# EAGLE design neurite-core (EAGLE 7.3.0)
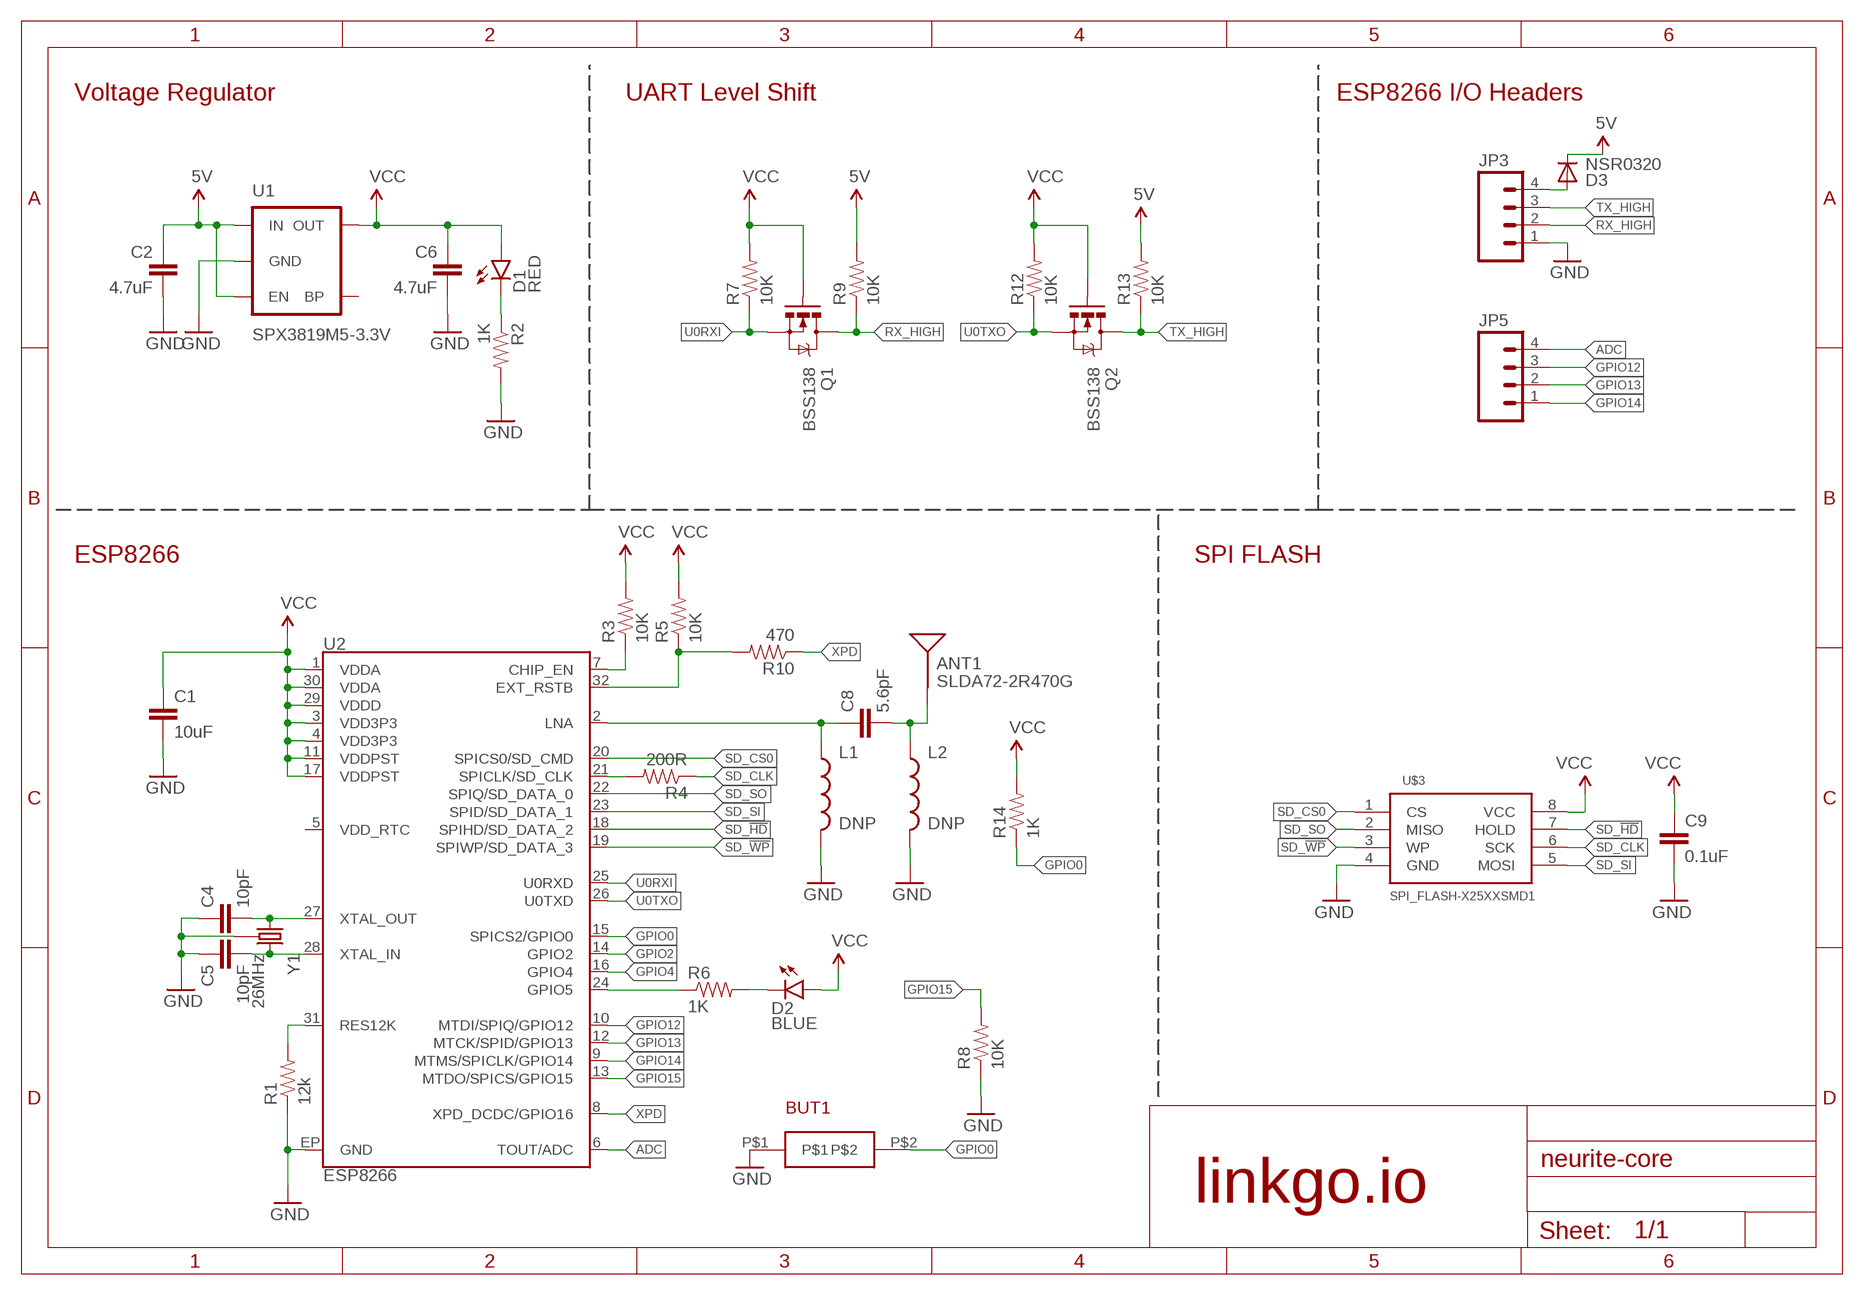
[diagram p0: schematic, sheet 1]

## Parts
ANT1  SLDA72-2R470G  ANTENNA2SMD6  [ANTENNA-CHIP6]
BUT1  SWITCH  [SWITCH]
C1  10uF  CAP0402-CAP  [0402-CAP]
C2  4.7uF  1.0UF-25V-+80/-20(0805)  [0805]
C4  10pF  CAP0402-CAP  [0402-CAP]
C5  10pF  CAP0402-CAP  [0402-CAP]
C6  4.7uF  2.2UF-10V-20%(0603)  [0603-CAP]
C8  5.6pF  CAP0402-CAP  [0402-CAP]
C9  0.1uF  CAP0402-CAP  [0402-CAP]
D1  RED  LED-RED0603  [LED-0603]
D2  BLUE  LED-BLUE0603  [LED-0603]
D3  NSR0320  DIODESOD  [SOD-323]
JP3  M04PTH  [1X04]
JP5  M04PTH  [1X04]
L1  DNP  INDUCTOR0402  [C0402]
L2  DNP  INDUCTOR0402  [C0402]
Q1  BSS138  MOSFET-NCHANNELBSS138  [SOT23-3]
Q2  BSS138  MOSFET-NCHANNELBSS138  [SOT23-3]
R1  12k  RESISTOR0402-RES  [0402-RES]
R2  1K  RESISTOR0402-RES  [0402-RES]
R3  10K  RESISTOR0402-RES  [0402-RES]
R4  200R  RESISTOR0402-RES  [0402-RES]
R5  10K  RESISTOR0402-RES  [0402-RES]
R6  1K  RESISTOR0402-RES  [0402-RES]
R7  10K  RESISTOR0402-RES  [0402-RES]
R8  10K  RESISTOR0402-RES  [0402-RES]
R9  10K  RESISTOR0402-RES  [0402-RES]
R10  470  RESISTOR0402-RES  [0402-RES]
R12  10K  RESISTOR0402-RES  [0402-RES]
R13  10K  RESISTOR0402-RES  [0402-RES]
R14  1K  RESISTOR0402-RES  [0402-RES]
U1  SPX3819M5-3.3V  V_REG_LDOSMD  [SOT23-5]
U2  ESP8266  [QFN32]
U$3  SPI_FLASH-X25XXSMD1  [SO08-EIAJ]
Y1  26MHz  CRYSTAL-GROUNDED3.2X2.5  [CRYSTAL-SMD-3.2X2.5]

## Nets
5V: C2.1 D3.1(C) R9.2 R13.2 U1.1(IN) U1.3(EN)
ADC: JP5.4 U2.6(TOUT/ADC)
CHIP_EN: R3.1 U2.7(CHIP_EN)
GND: BUT1.P$1 C1.2 C2.2 C4.1 C5.1 C6.2 C9.2 JP3.1 L1.2 L2.2 R1.1 R2.2 R8.1 U1.2(GND) U2.EP(GND) U$3.4(GND) Y1.2(GND) Y1.4(GND)
GPIO0: BUT1.P$2 R14.1 U2.15(SPICS2/GPIO0)
GPIO2: U2.14(GPIO2)
GPIO4: U2.16(GPIO4)
GPIO5: R6.1 U2.24(GPIO5)
GPIO12: JP5.3 U2.10(MTDI/SPIQ/GPIO12)
GPIO13: JP5.2 U2.12(MTCK/SPID/GPIO13)
GPIO14: JP5.1 U2.9(MTMS/SPICLK/GPIO14)
GPIO15: R8.2 U2.13(MTDO/SPICS/GPIO15)
LNA: C8.1 L1.1 U2.2(LNA)
N$1: R1.2 U2.31(RES12K)
N$2: C5.2 U2.28(XTAL_IN) Y1.3
N$3: C4.2 U2.27(XTAL_OUT) Y1.1
N$4: D1.C R2.1
N$5: ANT1.1(SIGNAL) C8.2 L2.1
N$6: R4.2 U2.21(SPICLK/SD_CLK)
N$7: D3.2(A) JP3.4
N$9: D2.C R6.2
RESET: R5.1 R10.2 U2.32(EXT_RSTB)
RX_HIGH: JP3.2 Q1.3(D) R9.1
SD_!HD!: U2.18(SPIHD/SD_DATA_2) U$3.7(HOLD)
SD_!WP!: U2.19(SPIWP/SD_DATA_3) U$3.3(WP)
SD_CLK: R4.1 U$3.6(SCK)
SD_CS0: U2.20(SPICS0/SD_CMD) U$3.1(CS)
SD_SI: U2.23(SPID/SD_DATA_1) U$3.5(MOSI)
SD_SO: U2.22(SPIQ/SD_DATA_0) U$3.2(MISO)
TX_HIGH: JP3.3 Q2.3(D) R13.1
U0RXI: Q1.2(S) R7.1 U2.25(U0RXD)
U0TXO: Q2.2(S) R12.1 U2.26(U0TXD)
VCC: C1.1 C6.1 C9.1 D1.A D2.A Q1.1(G) Q2.1(G) R3.2 R5.2 R7.2 R12.2 R14.2 U1.5(OUT) U2.1(VDDA) U2.3(VDD3P3) U2.4(VDD3P3) U2.11(VDDPST) U2.17(VDDPST) U2.29(VDDD) U2.30(VDDA) U$3.8(VCC)
XPD: R10.1 U2.8(XPD_DCDC/GPIO16)
Unconnected: U1.4(BP) U2.5(VDD_RTC)

## Notes on the sheet
- Voltage Regulator | UART Level Shift | ESP8266 I/O Headers
- ESP8266 | SPI FLASH
- linkgo.io

## Library data of the parts
ANT1 = SparkFun:ANTENNA2: Antenna Single endded antenna. Common with smaller chip antennas. CHIP4 package is the GPS Chip Antenna SKU: GPS-08418. CHIP5 package is 2.4GHz chip antenna SKU: WRL-00144.
BUT1 = Sincoheren:SWITCH
C1 C4 C5 C9 = SparkFun:CAP: Capacitor Standard 0603 ceramic capacitor, and 0.1" leaded capacitor.
C2 = SparkFun-Capacitors:1.0UF-25V-+80/-20(0805): CAP-11625; PROD_ID: CAP-11625; VALUE: 1.0uF
C6 = SparkFun-Capacitors:2.2UF-10V-20%(0603): CAP-07888; PROD_ID: CAP-07888; VALUE: 2.2uF
C8 = SparkFun:CAP: Capacitor Standard 0603 ceramic capacitor, and 0.1" leaded capacitor.; PROD_ID: CAP-12456
D1 = SparkFun-LED:LED-RED: Assorted Red LEDs LilyPad 1206- DIO-09912 1206- DIO-00809 0603- DIO-00819; PROD_ID: DIO-00819
D2 = SparkFun-LED:LED-BLUE: Blue LEDs for production use Various blue LEDs stocked by SparkFun production 0603 - DIO-08575 Rebel - DIO-09553 1206 - DIO-09911; PROD_ID: DIO-08575
D3 = SparkFun:DIODE: Diode These are standard reverse protection diodes and small signal diodes. SMA package can handle up to about 1A. SOD-323 can handle about 200mA. What the SOD-323 package when ordering, there are some mfgs out there that are 5-pin packages.
JP3 JP5 = SparkFun:M04: Header 4 Standard 4-pin 0.1" header. Use with straight break away headers (SKU : PRT-00116), right angle break away headers (PRT-00553), swiss pins (PRT-00743), machine pins (PRT-00117), and female headers (PRT-00115). Molex polarized connector foot print use with SKU : PRT-08231 with associated crimp pins and housings.
L1 L2 = SparkFun:INDUCTOR: Inductors Basic Inductor/Choke - 0603 and 1206. Footprints are not proven and vary greatly between part numbers.
Q1 Q2 = SparkFun-DiscreteSemi:MOSFET-NCHANNEL: Common NMOSFET Parts MFG P/N Store ID Prod ID FDD8780 TRANS-09984 SI7820DN TRANS-11055 FDS6630A IC-08089 2N7002PW TRANS-11151 FQP30N06L COM-10213 TRANS-10060 BSS123LT1G TRANS-08345 BSS138 TRANS-00830 BS170 2N7000; PROD_ID: TRANS-00830; VALUE: 200mA/50V
R1-R10 R12-R14 = SparkFun:RESISTOR: Resistor Basic schematic elements and footprints for 0603, 1206, and PTH 1/10th watt (small) resistors.
U1 = SparkFun-PowerIC:V_REG_LDO: Voltage Regulator LDO Standard 150mA LDO voltage regulator in SOT-23 layout. Micrel part MIC5205. BP (by-pass) pin is used to lower output noise with 470pF cap.; PROD_ID: VREG-12457
U2 = esp8266-development-board:ESP8266: Espressif ESP8266 WiFi Smart Connectivity Platform.; PROD_ID: IC-12452
U$3 = SparkFun:SPI_FLASH-X25XX: 8pin SPI Flash series x25xx. Works with devices like W25X32 and BR25L32
Y1 = things:CRYSTAL-GROUNDED; PROD_ID: XTAL-12454

## Board
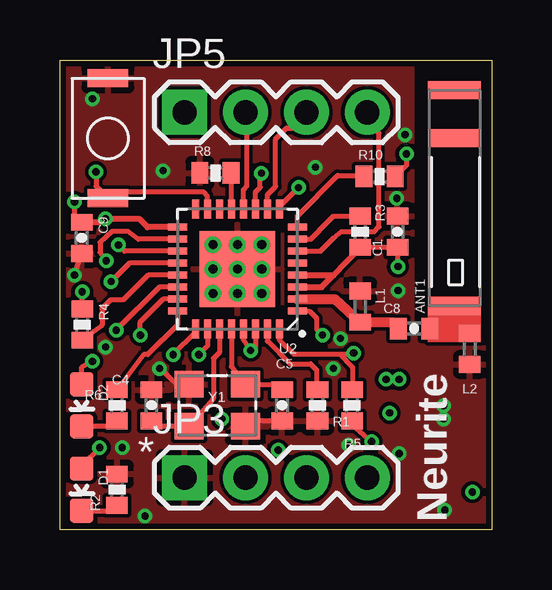
[diagram p1: board, top side]
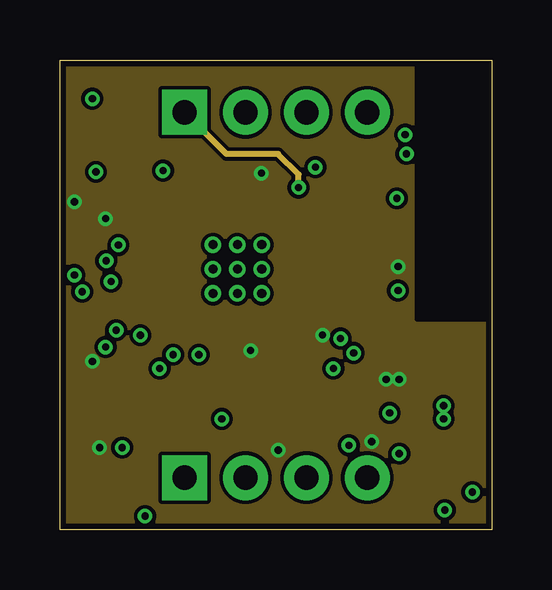
[diagram p2: board, inner layer Route2]
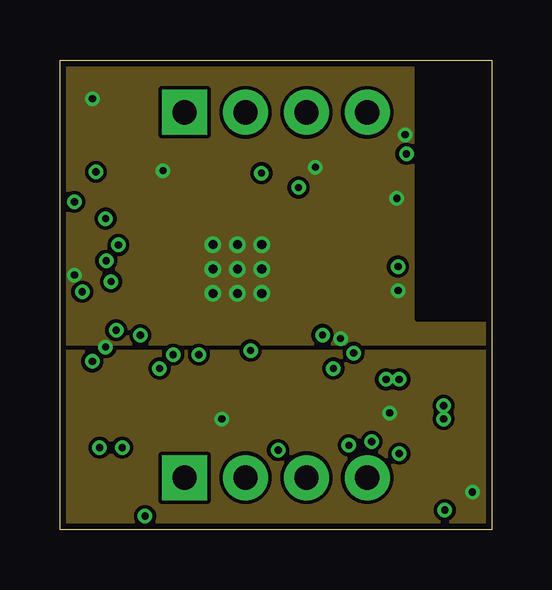
[diagram p3: board, inner layer Route5]
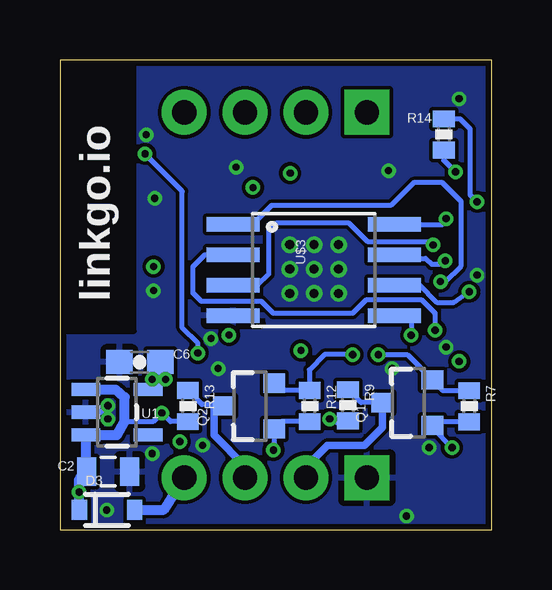
[diagram p4: board, bottom side, seen from below]

Size 18 x 19.6 mm. Coordinates in mm from the lower left corner, seen from the top.
Outline: 0,19.6 18,19.6 18,0 0,0 0,19.6
Copper layers (1*2+5*16): Top 0.035mm / dielectric 0.3mm / Route2 0.017mm / dielectric 0.3mm / Route5 0.017mm / dielectric 0.3mm / Bottom 0.017mm
Design rules "jlc *": minimum track width 6mil, minimum drill 0.3mm, track to track 6mil, track to pad 6mil, pad to pad 6mil, via to via 6mil, smd to smd 6mil, copper to edge 10mil, drill to drill 8mil, minimum pad ring 6mil, minimum via ring 6mil, stop-mask expansion 4mil, vias tented up to drill 20mil, thermal gap 10mil

### Footprints (pad centres in the part's own frame; a part is rotated, then mirrored left to right if it is on the bottom)
ANTENNA-CHIP6 = smd 0.75 x 2.2: 1 -3.5,0.05; 2 3.5,0.05; NC 5.5,0.05
SWITCH = smd 0.75 x 1.7: P$1 0,1.5; P$2 5,1.5
0402-CAP = smd 0.7 x 0.9: 1 -0.65,0; 2 0.65,0
0805 = smd 0.8 x 1.2: 1 -0.9,0; 2 0.9,0
0603-CAP = smd 1.1 x 1: 1 -0.85,0; 2 0.85,0
LED-0603 = smd 1 x 1: A 0,-0.877; C 0,0.877
SOD-323 = smd 0.63 x 0.83: 1 -1.15,0; 2 1.15,0
1X04 = drill 1.016 pad 1.88 square: 1 0,0 | drill 1.016 pad 1.88: 2 2.54,0; 3 5.08,0; 4 7.62,0
C0402 = smd 0.7 x 0.9: 1 -0.65,0; 2 0.65,0
SOT23-3 = smd 0.8 x 0.9: 1 -0.95,-1; 2 0.95,-1; 3 0,1.1
0402-RES = smd 0.7 x 0.9: 1 -0.65,0; 2 0.65,0
SOT23-5 = smd 0.55 x 1.2: 1 -0.95,-1.3; 2 0,-1.3; 3 0.95,-1.3; 4 0.95,1.3; 5 -0.95,1.3
QFN32 = smd 0.8 x 0.285: 1 -2.5,1.75; 2 -2.5,1.25; 3 -2.5,0.75; 4 -2.5,0.25; 5 -2.5,-0.25; 6 -2.5,-0.75; 7 -2.5,-1.25; 8 -2.5,-1.75; 17 2.5,-1.75; 18 2.5,-1.25; 19 2.5,-0.75; 20 2.5,-0.25; 21 2.5,0.25; 22 2.5,0.75; 23 2.5,1.25; 24 2.5,1.75 | smd 0.285 x 0.8: 9 -1.75,-2.5; 10 -1.25,-2.5; 11 -0.75,-2.5; 12 -0.25,-2.5; 13 0.25,-2.5; 14 0.75,-2.5; 15 1.25,-2.5; 16 1.75,-2.5; 25 1.75,2.5; 26 1.25,2.5; 27 0.75,2.5; 28 0.25,2.5; 29 -0.25,2.5; 30 -0.75,2.5; 31 -1.25,2.5; 32 -1.75,2.5 | smd 3.15 x 3.15: EP 0,0
SO08-EIAJ = smd 0.61 x 2.21: 1 -1.905,-3.378; 2 -0.635,-3.378; 3 0.635,-3.378; 4 1.905,-3.378; 5 1.905,3.353; 6 0.635,3.353; 7 -0.635,3.353; 8 -1.905,3.353
CRYSTAL-SMD-3.2X2.5 = smd 1.2 x 1.1: 1 -1.175,-0.875; 2 1.175,-0.875; 3 1.175,0.875; 4 -1.175,0.875

### Placement (x,y rotation side)
ANT1  16.5,12.84 90 top
BUT1  0.5,18.83 270 top
C1  14.08,12.44 90 top
C2  15.99,2.43 0 bottom
C4  3.81,5.2 270 top
C5  9.27,5.2 90 top
C6  14.67,7 180 bottom
C8  14.77,8.4 0 top
C9  0.91,12.18 270 top
D1  0.91,1.68 180 top
D2  0.91,5.2 180 top
D3  16.04,0.84 0 bottom
JP3  5.2,2.18 0 top
JP5  5.2,17.42 0 top
L1  12.52,9.31 90 top
L2  17.09,7.55 270 top
Q1  3.47,5.31 90 bottom
Q2  10.07,5.17 90 bottom
R1  10.74,5.2 90 top
R2  2.38,1.68 90 top
R3  12.52,12.44 270 top
R4  0.93,8.56 270 top
R5  12.18,5.2 270 top
R6  2.38,5.2 270 top
R7  0.93,5.16 270 bottom
R8  6.49,14.89 0 top
R9  5.99,5.2 270 bottom
R10  13.33,14.74 0 top
R12  7.58,5.17 270 bottom
R13  12.66,5.17 270 bottom
R14  1.99,16.49 90 bottom
U1  15.62,4.91 270 bottom
U2  7.4,10.88 180 top
U$3  7.4,10.84 270 bottom
Y1  6.56,5.2 0 top

### Tracks (layer width: path | path; a pad name or v marks a point on that pad's centre or on a via)
5V  (via drill 0.3)
  Bottom 0.203: R13.2 13.39,4.52 v13.75,4.88 14.1,4.53 15.3,4.53 | v17.2,1.58 17.2,1.87 17.19,1.88 | 6.28,4.55 R9.2 6.21,4.33 v6.75,4.63
  Bottom 0.406: D3.1 17.19,1.88 17.19,2.13 C2.1 16.92,2.46 U1.3 15.62,3.96 15.3,4.53 15.3,5.53 15.68,5.86 U1.1
  pour Route5: -0.65,-0.72 -0.65,7.43 19.1,7.43 19.1,-0.72
ADC
  Top 0.203: U2.6 10.87,11.63 11.43,12.19 11.73,12.44 13.11,12.44 13.31,12.65 13.31,16.53 JP5.4
CHIP_EN
  Top 0.203: U2.7 10.46,12.13 10.82,12.49 10.82,12.5 11.4,13.08 R3.1
GND  (via drill 0.3, 0.38)
  Top 0.203: 0.81,11.39 C9.2 v0.6,10.63 | Y1.4 4.86,6.07 v4.15,6.73 | C5.1 7.96,4.55 Y1.2
  Bottom 0.203: U1.2 16.32,4.91 v16,5.18
  other vias: 7.4,10.88 7.4,11.9 7.4,9.86 6.38,10.88 6.38,11.9 6.38,9.86 8.42,11.9 8.42,10.88 8.42,9.86 1.9,7.63 14.4,16.48 14.1,9.98 14.15,3.18 16,4.63 1.35,17.98 14.05,13.83 2.6,3.43 3.55,0.58 16.05,0.83 12.05,3.53 11.4,6.73 10.65,15.13 4.3,14.98 11.7,7.98
  pour Top: -0.1,19.78 18.3,19.78 18.3,-0.67 -0.1,-0.67
  pour Bottom: -0.25,19.93 18.5,19.93 18.5,-0.82 -0.25,-0.82
  pour Route5: 19.05,7.78 -0.65,7.78 -0.65,20.83 19.05,20.83
GPIO0  (via drill 0.3)
  Top 0.203: U2.15 6.15,13.93 6,14.08 2.25,14.08 BUT1.P$2 1.5,14.33 v1.5,14.93
  Bottom 0.203: R14.1 1.99,15.42 v1.5,14.93
GPIO5
  Top 0.203: U2.24 4.9,8.55 3.66,7.31 3.49,7.31 R6.1
GPIO12
  Top 0.203: U2.10 8.65,13.98 8.99,14.32 8.99,16.3 9.45,16.76 10.12,16.76 JP5.3
GPIO13
  Top 0.203: U2.12 7.65,14.18 7.8,14.33 7.8,16.86 JP5.2
GPIO14  (via drill 0.3)
  Top 0.203: U2.9 9.15,13.48 v9.95,14.28
  Route2 0.254: v9.95,14.28 9.95,14.83 9.1,15.68 6.94,15.68 JP5.1
GPIO15
  Top 0.203: U2.13 7.15,14.51 R8.2
LNA
  Top 0.406: C8.1 13.86,8.66 L1.1 11.45,9.63 U2.2
N$1
  Top 0.203: U2.31 8.65,7.88 9.6,6.93 10.45,6.93 10.7,6.68 10.7,6.09 R1.2
N$2
  Top 0.203: U2.28 7.15,6.81 Y1.3 9.39,6.07 C5.2
N$3
  Top 0.203: U2.27 6.65,7.41 6.4,7.16 6.4,5.49 Y1.1 3.84,4.32 C4.2
N$4
  Top 0.203: 0.91,0.69 D1.C 2.15,0.8 R2.1
N$5
  Top 0.203: C8.2 16.89,8.4 L2.1 16.45,8.84 ANT1.1
N$6
  Top 0.203: U2.21 3.68,10.63 2.65,9.6 2.12,9.6 1.75,9.23 1.75,8.53 R4.2
N$7
  Bottom 0.406: D3.2 13.66,0.84 JP3.4
N$8
  cutout Top: 14.9,19.48 17.9,19.48 17.9,8.28 14.9,8.28
N$9
  Top 0.203: D2.C 0.94,4.35 2.18,4.35 R6.2
N$10
  cutout Route2: 14.9,20.03 17.9,20.03 17.9,8.78 14.9,8.78
N$11
  cutout Route5: 14.9,20.08 17.9,20.08 17.9,8.78 14.9,8.78
N$12
  cutout Bottom: 14.9,19.68 17.9,19.68 17.9,8.28 14.9,8.28
RESET  (via drill 0.3)
  Top 0.203: U2.32 9.15,7.93 9.75,7.33 11.65,7.33 | 11.65,7.33 12.2,6.78 12.2,6.07 R5.1 | 11.65,7.33 12.2,7.33 v12.25,7.38 | v14.45,15.68 14.45,15.21 R10.2
  Bottom 0.203: v12.25,7.38 12.25,7.78 12.9,8.43 12.9,14.13 v14.45,15.68
RX_HIGH
  Bottom 0.203: Q1.3 5.45,5.31 R9.1
  Bottom 0.305: Q1.3 4.55,5.29 4.55,4.28 5.3,3.53 6.85,3.53 7.6,2.78 7.6,2.32 JP3.2
SD_!HD!  (via drill 0.3)
  Top 0.203: U2.18 3.26,12.13 2.84,12.45 2.18,12.45 1.68,11.99 1.68,11.58 v1.93,11.22
  Bottom 0.203: 4,11.42 U$3.7 3.89,11.32 2.74,11.32 2.5,11.08 2.07,11.08 v1.93,11.22
SD_!WP!  (via drill 0.3)
  Top 0.203: U2.19 2.69,11.63 v2.44,11.89
  Bottom 0.203: U$3.3 9.75,10.21 9.3,10.66 9.3,12.49 8.99,12.8 5.94,12.8 5.18,12.04 2.49,12.04 v2.44,11.89 | U$3.3
SD_CLK  (via drill 0.3)
  Top 0.203: R4.1 v0.93,9.93 0.93,9.98
  Bottom 0.203: U$3.6 3,10.21 2.28,9.49 1.57,9.49 v0.93,9.93
SD_CS0  (via drill 0.3)
  Top 0.203: U2.20 2.91,11.13 v2.13,10.36
  Bottom 0.203: U$3.1 10.73,12.8 9.91,12.8 9.17,13.53 4.2,13.53 3.25,14.48 2.05,14.48 1.27,13.7 1.27,11.02 1.93,10.36 v2.13,10.36
SD_SI  (via drill 0.3)
  Top 0.203: v3.35,8.12 3.35,8.68 4.3,9.63 U2.23
  Bottom 0.203: U$3.5 3.35,8.76 v3.35,8.12
SD_SO  (via drill 0.3)
  Top 0.203: U2.22 4.15,10.13 v2.35,8.33
  Bottom 0.203: v2.35,8.33 2.35,9.03 2.9,9.58 5.25,9.58 5.8,9.03 9.1,9.03 9.6,9.53 12.1,9.53 12.45,9.88 12.45,10.98 11.95,11.48 U$3.2
TX_HIGH
  Bottom 0.203: 11.58,5.23 12.07,5.23 R13.1
  Bottom 0.305: JP3.3 10.28,2.65 11.58,3.96 11.58,5.23 Q2.3
U0RXI  (via drill 0.3)
  Top 0.203: U2.25 5.65,8.23 v4.72,7.31
  Bottom 0.203: v4.72,7.31 3.52,7.31 Q1.2 2.02,5.81 R7.1
U0TXO  (via drill 0.3)
  Top 0.203: U2.26 6.15,7.67 v5.79,7.31
  Bottom 0.203: Q2.2 8.77,5.82 R12.1 7.6,5.84 7.6,6.68 6.97,7.31 v5.79,7.31
VCC  (via drill 0.3)
  Top 0.203: R3.2 C1.1 14.1,11.92 v14.1,10.98 | R5.2 12.18,4.4 v13,3.68 | D1.A 0.91,2.69 v1.65,3.43 | U2.11 8.15,14.08 8.35,14.28 8.35,14.83 v8.4,14.88 | U2.30 8.15,7.63 v7.95,7.48 7.65,7.93 U2.29 | U2.1 10.4,9.13 10.7,8.83 10.7,8.38 v10.95,8.13 | v0.6,13.68 0.6,13.14 C9.1 | D2.A 0.91,6.79 v1.35,7.03
  Top 0.254: U2.4 11.41,10.63 | 11.41,10.63 R3.2 | U2.3 10.91,10.13 11.41,10.63 | U2.17 3.65,12.63 3.3,12.98 v1.9,12.98 1.65,12.83 C9.1
  Bottom 0.203: 2.37,4.46 Q1.1 | R12.2 8.77,4.52 Q2.1 9.07,3.36 v9.1,3.33 | R7.2 2.32,4.51 Q1.1 | C6.1 13.82,6.46 v14.15,6.28 14.32,5.96 U1.5 | Q1.1 2.47,4.25 v1.65,3.43 | R14.2 1.31,17.14 0.9,16.73 0.9,13.98 v0.6,13.68 | 3.54,12.74 2.04,12.74 v1.9,12.98
  Bottom 0.305: U$3.8 3.54,12.74
  other vias: 13.6,6.28
  pour Route2: -0.45,20.63 18.75,20.63 18.75,-0.47 -0.45,-0.47
XPD
  Top 0.203: U2.8 9.9,13.1 11.58,14.78 12.44,14.78 R10.1
(copper drawn outside any net)
  shapes: Top area x1

### Text on the board
tPlace: * | Neurite
bPlace: linkgo.io
Document: BUTTON.GPIO0 | 8.GPIO14 | 7.GPIO13 | 6.GPIO12 | 5.ADC | LED.GPIO5 | LED.POWER | 1.GND | 2.RXD | 3.TXD | 4.VCC | (3.3V-5V)